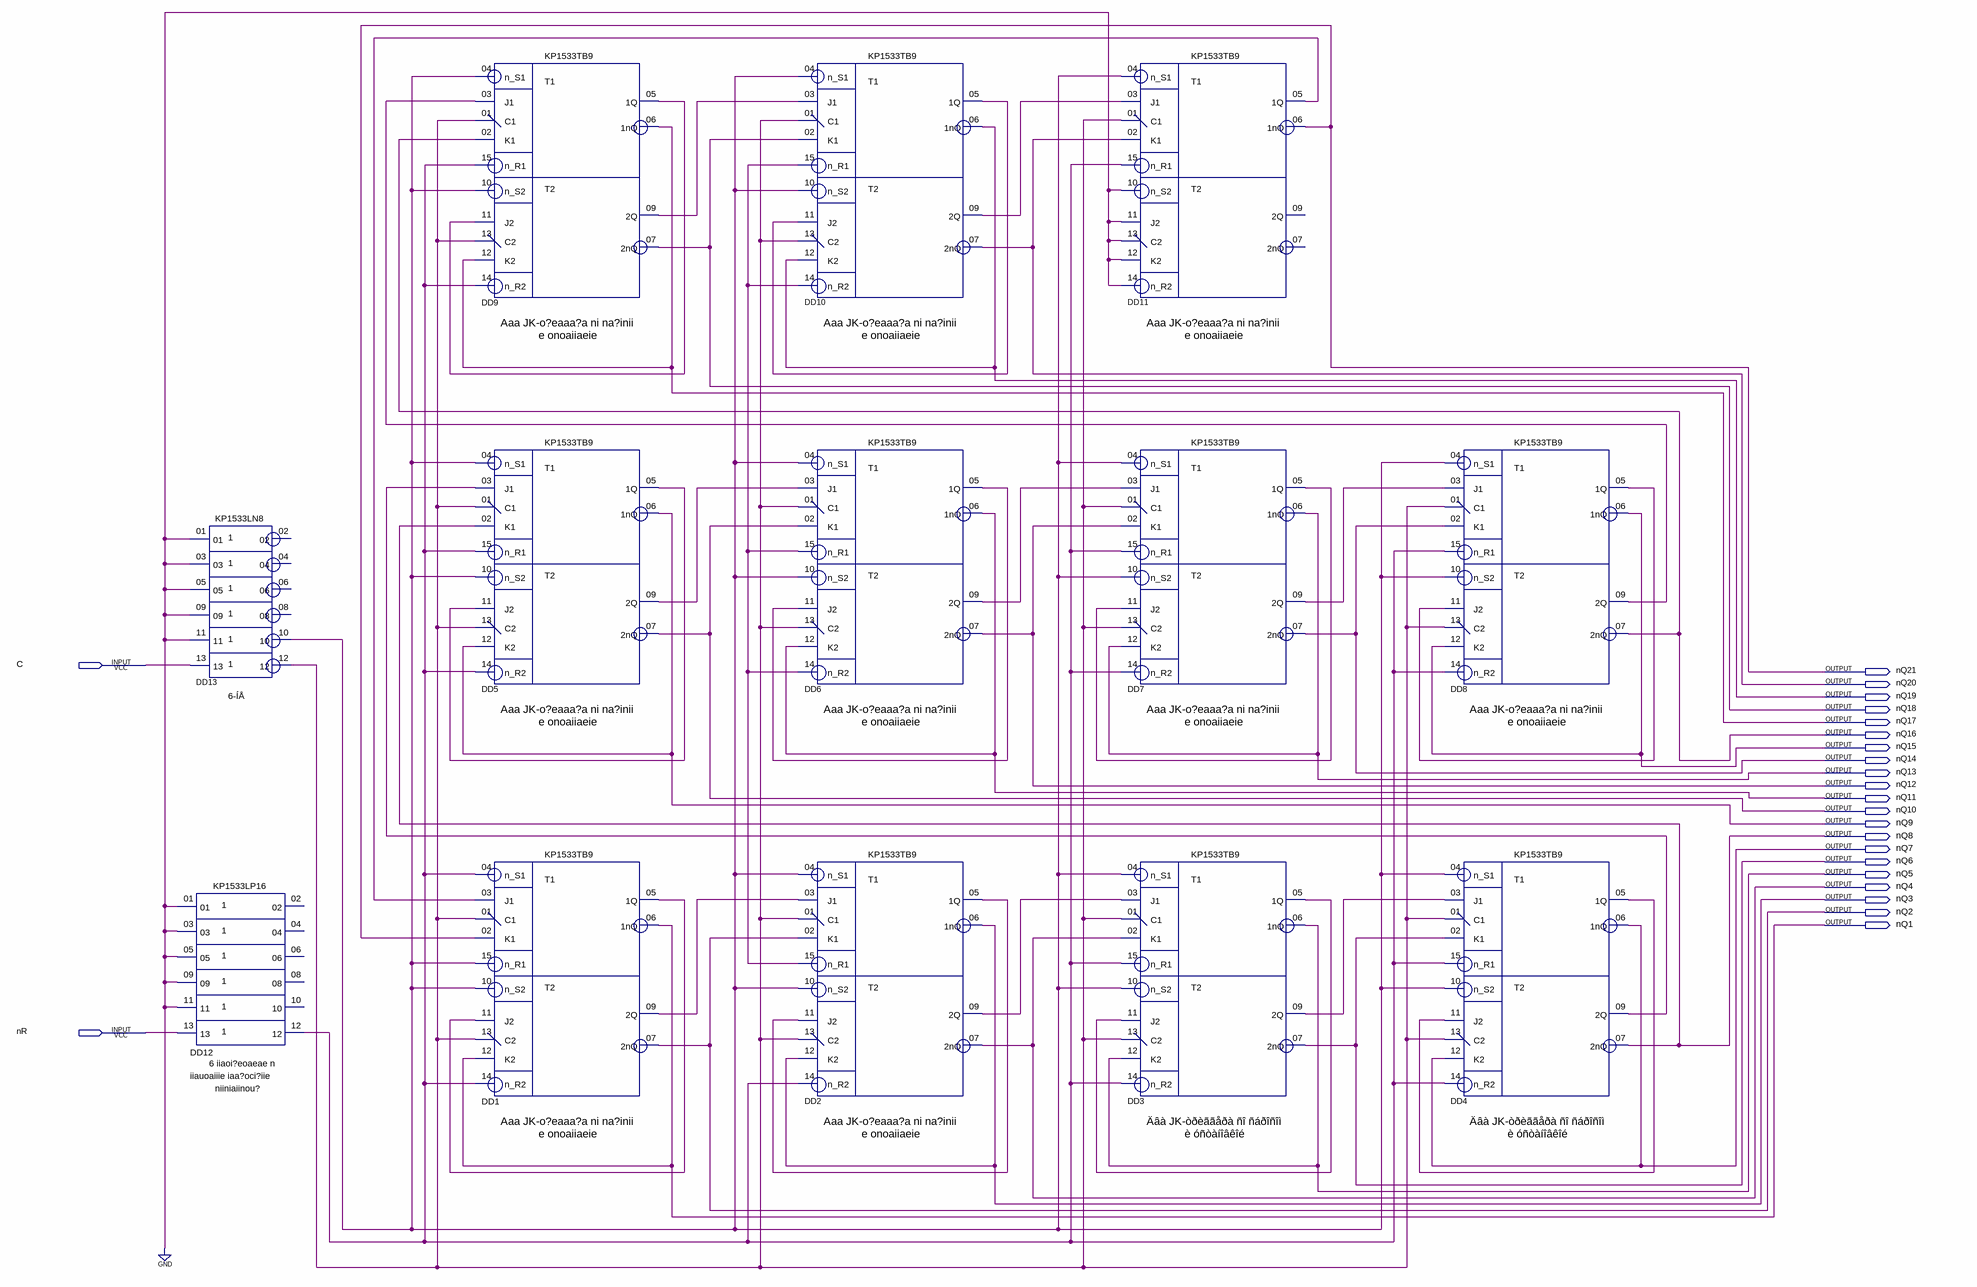
[diagram p0: schematic sheet]
// Quartus schematic RingCounterJKFF.bdf as structural Verilog: 13 symbols, 23 pins
module RingCounterJKFF (
  input  C,
  input  nR,
  output nQ21,
  output nQ20,
  output nQ19,
  output nQ18,
  output nQ17,
  output nQ16,
  output nQ15,
  output nQ14,
  output nQ13,
  output nQ12,
  output nQ11,
  output nQ10,
  output nQ9,
  output nQ8,
  output nQ7,
  output nQ6,
  output nQ5,
  output nQ4,
  output nQ3,
  output nQ2,
  output nQ1
);

  wire DD1_1q, DD1_2q, DD2_1q, DD2_2q, DD3_1q, DD3_2q, DD4_1q, DD4_2q, DD5_1q, DD5_2q, DD6_1q, DD6_2q,
       DD7_1q, DD7_2q, DD8_1q, DD8_2q, DD9_1q, DD9_2q, DD10_1q, DD10_2q, DD11_1q, DD12_12, DD13_10, DD13_12,
       undriven;

  KP1533LN8 DD13 (
    .\01 (1'b0), .\03 (1'b0), .\05 (1'b0), .\09 (1'b0), .\11 (1'b0), .\13 (C), .\10 (DD13_10), .\12 (DD13_12));  // open: 02, 04, 06, 08
  KP1533LP16 DD12 (
    .\01 (1'b0), .\03 (1'b0), .\05 (1'b0), .\09 (1'b0), .\11 (1'b0), .\13 (nR), .\12 (DD12_12));  // open: 02, 04, 06, 08, 10
  KP1533TB9 DD9 (
    .n_S1(DD13_10), .J1(DD8_2q), .n_R1(DD12_12), .C1(DD13_12), .K1(nQ16), .n_S2(DD13_10), .J2(DD9_1q),
    .n_R2(DD12_12), .C2(DD13_12), .K2(nQ17), .\1Q (DD9_1q), .\1nQ (nQ17), .\2Q (DD9_2q), .\2nQ (nQ18));
  KP1533TB9 DD5 (
    .n_S1(DD13_10), .J1(DD4_2q), .n_R1(DD12_12), .C1(DD13_12), .K1(nQ8), .n_S2(DD13_10), .J2(DD5_1q),
    .n_R2(DD12_12), .C2(DD13_12), .K2(nQ9), .\1Q (DD5_1q), .\1nQ (nQ9), .\2Q (DD5_2q), .\2nQ (nQ10));
  KP1533TB9 DD1 (
    .n_S1(DD12_12), .J1(DD11_1q), .n_R1(DD13_10), .C1(DD13_12), .K1(nQ21), .n_S2(DD13_10), .J2(DD1_1q),
    .n_R2(DD12_12), .C2(DD13_12), .K2(nQ1), .\1Q (DD1_1q), .\1nQ (nQ1), .\2Q (DD1_2q), .\2nQ (nQ2));
  KP1533TB9 DD10 (
    .n_S1(DD13_10), .J1(DD9_2q), .n_R1(undriven), .C1(DD13_12), .K1(nQ18), .n_S2(DD13_10), .J2(DD10_1q),
    .n_R2(undriven), .C2(DD13_12), .K2(nQ19), .\1Q (DD10_1q), .\1nQ (nQ19), .\2Q (DD10_2q), .\2nQ (nQ20));
  KP1533TB9 DD6 (
    .n_S1(DD13_10), .J1(DD5_2q), .n_R1(undriven), .C1(DD13_12), .K1(nQ10), .n_S2(DD13_10), .J2(DD6_1q),
    .n_R2(undriven), .C2(DD13_12), .K2(nQ11), .\1Q (DD6_1q), .\1nQ (nQ11), .\2Q (DD6_2q), .\2nQ (nQ12));
  KP1533TB9 DD2 (
    .n_S1(DD13_10), .J1(DD1_2q), .n_R1(undriven), .C1(DD13_12), .K1(nQ2), .n_S2(DD13_10), .J2(DD2_1q),
    .n_R2(DD12_12), .C2(DD13_12), .K2(nQ3), .\1Q (DD2_1q), .\1nQ (nQ3), .\2Q (DD2_2q), .\2nQ (nQ4));
  KP1533TB9 DD11 (
    .n_S1(DD13_10), .J1(DD10_2q), .n_R1(DD12_12), .C1(DD13_12), .K1(nQ20), .n_S2(1'b0), .J2(1'b0),
    .n_R2(1'b0), .C2(1'b0), .K2(1'b0), .\1Q (DD11_1q), .\1nQ (nQ21));  // open: 2Q, 2nQ
  KP1533TB9 DD7 (
    .n_S1(DD13_10), .J1(DD6_2q), .n_R1(DD12_12), .C1(DD13_12), .K1(nQ12), .n_S2(DD13_10), .J2(DD7_1q),
    .n_R2(DD12_12), .C2(DD13_12), .K2(nQ13), .\1Q (DD7_1q), .\1nQ (nQ13), .\2Q (DD7_2q), .\2nQ (nQ14));
  KP1533TB9 DD3 (
    .n_S1(DD13_10), .J1(DD2_2q), .n_R1(DD12_12), .C1(DD13_12), .K1(nQ4), .n_S2(DD13_10), .J2(DD3_1q),
    .n_R2(DD12_12), .C2(DD13_12), .K2(nQ5), .\1Q (DD3_1q), .\1nQ (nQ5), .\2Q (DD3_2q), .\2nQ (nQ6));
  KP1533TB9 DD8 (
    .n_S1(DD13_10), .J1(DD7_2q), .n_R1(DD12_12), .C1(DD13_12), .K1(nQ14), .n_S2(DD13_10), .J2(DD8_1q),
    .n_R2(DD12_12), .C2(DD13_12), .K2(nQ15), .\1Q (DD8_1q), .\1nQ (nQ15), .\2Q (DD8_2q), .\2nQ (nQ16));
  KP1533TB9 DD4 (
    .n_S1(DD13_10), .J1(DD3_2q), .n_R1(DD12_12), .C1(DD13_12), .K1(nQ6), .n_S2(DD13_10), .J2(DD4_1q),
    .n_R2(DD12_12), .C2(DD13_12), .K2(nQ7), .\1Q (DD4_1q), .\1nQ (nQ7), .\2Q (DD4_2q), .\2nQ (nQ8));
endmodule
